# EAGLE design opencopcho (EAGLE 9.2.2)
Assembly variants: basic
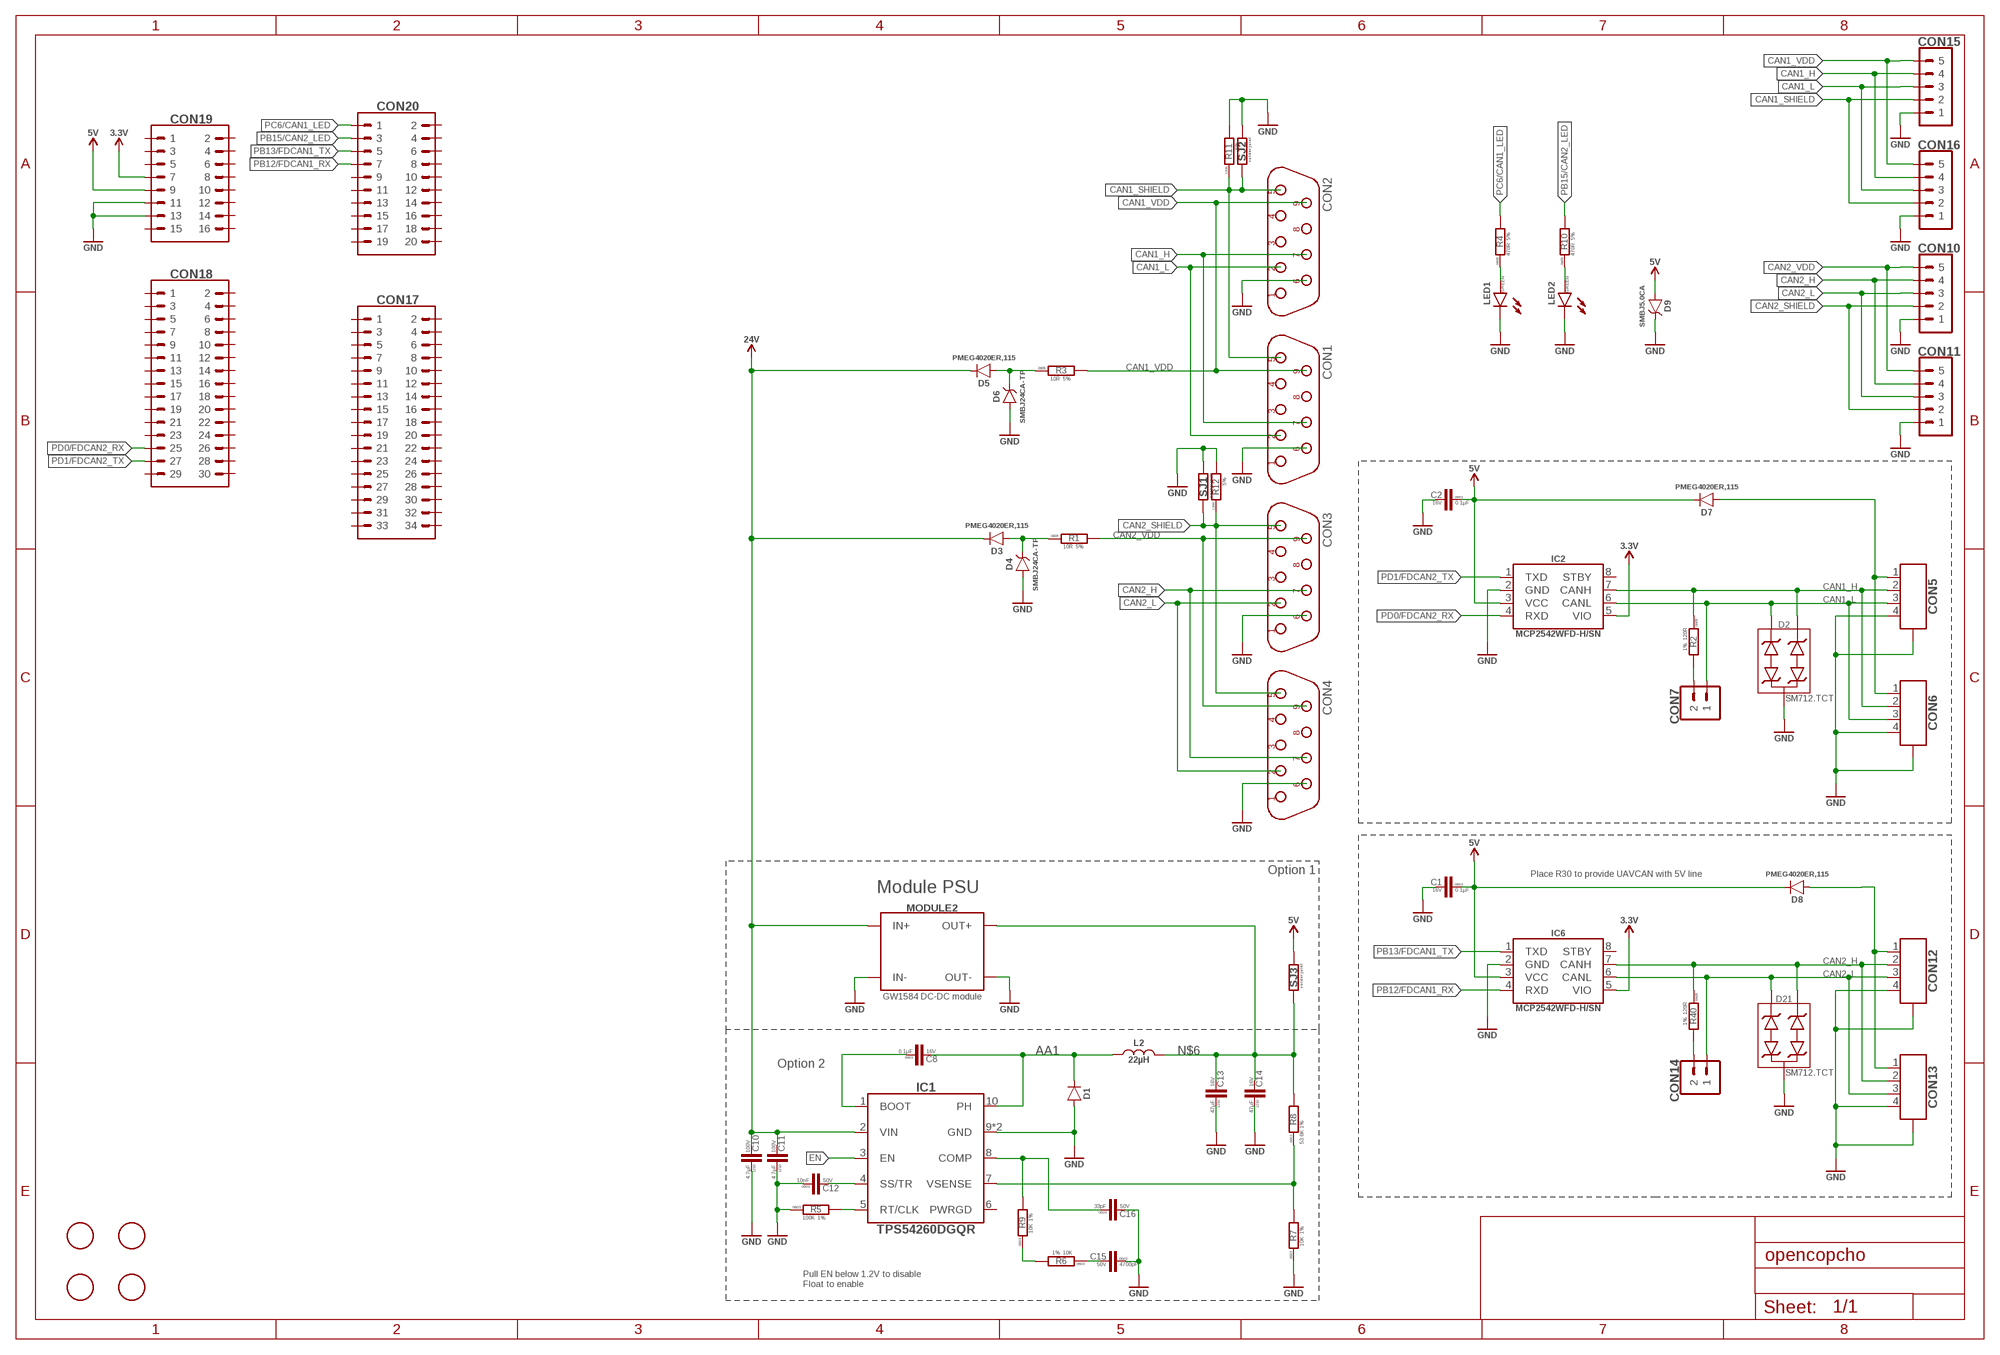
[diagram p0: schematic, sheet 1]

## Parts
C1  0.1µF  0.1µF-16V_10%_X7R-0603  [C0603]
C2  0.1µF  0.1µF-16V_10%_X7R-0603  [C0603]
C8  0.1µF  0.1µF-16V_10%_X7R-0603  [C0603]  (not fitted in variant basic)
C10  4.7µF  4.7µF-100V_20%_X7S-1210  [C1210]  (not fitted in variant basic)
C11  4.7µF  4.7µF-100V_20%_X7S-1210  [C1210]  (not fitted in variant basic)
C12  10nF  10NF-50V_10%_X7R-0603  [C0603]  (not fitted in variant basic)
C13  47µF  47µF-16V_20%_X5R-1210  [C1210]  (not fitted in variant basic)
C14  47µF  47µF-16V_20%_X5R-1210  [C1210]  (not fitted in variant basic)
C15  4700pF  4700PF-50V_10%_X7R-0603  [C0603]  (not fitted in variant basic)
C16  33pF  33PF-50V_5%_NP0-0603  [C0603]  (not fitted in variant basic)
CON1  DB9-M  [D-09M]
CON2  DB9-M  [D-09M]
CON3  DB9-M  [D-09M]
CON4  DB9-M  [D-09M]
CON5  CON-4P-JST_GH-RA  [JST_GH-4P-RA]
CON6  CON-4P-JST_GH-RA  [JST_GH-4P-RA]
CON7  PINHEAD_1X02-2.54  [1X02-PTH-2.54]
CON10  PINHEAD_1X05-2.54-KEY  [1X05-PTH-2.54-KEY]
CON11  PINHEAD_1X05-2.54-KEY  [1X05-PTH-2.54-KEY]
CON12  CON-4P-JST_GH-RA  [JST_GH-4P-RA]
CON13  CON-4P-JST_GH-RA  [JST_GH-4P-RA]
CON14  PINHEAD_1X02-2.54  [1X02-PTH-2.54]
CON15  PINHEAD_1X05-2.54-KEY  [1X05-PTH-2.54-KEY]
CON16  PINHEAD_1X05-2.54-KEY  [1X05-PTH-2.54-KEY]
CON17  PINHEAD_2X17-TH-FEMALE-LONG  [2X17-PTH-2.54-FEMALE-LONG_PINS]
CON18  PINHEAD_2X15-2.54-FEMALE-LONG  [2X15-PTH-2.54-FEMALE-LONG-PINS]
CON19  PINHEAD_2X08-TH-FEMALE-LONG  [2X08-PTH-2.54-FEMALE-LONG-PINS]
CON20  PINHEAD_2X10-2.54-TH-FEMALE-LONG  [2X10-PTH-2.54-FEMALE-LONG-PINS]
D1  B360B  [DO-214AA(SMB)]  (not fitted in variant basic)
D2  SM712  [SOT23B-3]
D3  PMEG4020  [SOD123W]
D4  SMBJ24CA-SMB  [DO-214AA(SMB)]
D5  PMEG4020  [SOD123W]
D6  SMBJ24CA-SMB  [DO-214AA(SMB)]
D7  PMEG4020  [SOD123W]
D8  PMEG4020  [SOD123W]
D9  SMBJ5.0CA-SMB  [DO-214AA(SMB)]
D21  SM712  [SOT23B-3]
IC1  TPS54260  [MSOP10]  (not fitted in variant basic)
IC2  MCP2542WFD  [SOIC8-3.9]
IC6  MCP2542WFD  [SOIC8-3.9]
L2  22µH  22µH-22U-SRP6540  [SRP6540]  (not fitted in variant basic)
LED1  LED-0805  [LED0805]
LED2  LED-0805  [LED0805]
MODULE2  GW1584_MODULE  [GW1584_MODULE]
R1  10R  R-5%-0805  [R0805]
R2  120R  R-1%-0805  [R0805]
R3  10R  R-5%-0805  [R0805]
R4  470R  R-5%-0805  [R0805]
R5  100K  100K-1%-0603  [R0603]  (not fitted in variant basic)
R6  10K  10K-1%-0603  [R0603]  (not fitted in variant basic)
R7  10K  10K-1%-0603  [R0603]  (not fitted in variant basic)
R8  53.6K 1%  R-1%-0603  [R0603]  (not fitted in variant basic)
R9  10K  10K-1%-0603  [R0603]  (not fitted in variant basic)
R10  470R  R-5%-0805  [R0805]
R11  R-5%-1206  [R1206]  (not fitted in variant basic)
R12  R-5%-1206  [R1206]  (not fitted in variant basic)
R40  120R  R-1%-0805  [R0805]
SJ1  SOLDER_JOINT  [RES_0]  (not fitted in variant basic)
SJ2  SOLDER_JOINT  [RES_0]
SJ3  SOLDER_JOINT  [RES_0]  (not fitted in variant basic)
U$5  FIDUCIALMOUNT  [FIDUCIA-MOUNT]  (not fitted in variant basic)
U$6  FIDUCIALMOUNT  [FIDUCIA-MOUNT]  (not fitted in variant basic)
U$7  FIDUCIALMOUNT  [FIDUCIA-MOUNT]  (not fitted in variant basic)
U$11  FIDUCIALMOUNT  [FIDUCIA-MOUNT]  (not fitted in variant basic)

## Nets
AA1: C8.P$2 D1.C IC1.10(PH) L2.1
CAN1_H: CON1.7 CON2.7 CON5.2 CON6.2 CON15.4 CON16.4 D2.1(C3) IC2.7(CANH) R2.1
CAN1_L: CON1.2 CON2.2 CON5.3 CON6.3 CON7.1 CON15.3 CON16.3 D2.2(C2) IC2.6(CANL)
CAN1_SHIELD: CON1.5 CON2.5 CON15.2 CON16.2 R11.P$1 SJ2.1
CAN1_VDD: CON1.9 CON2.9 CON15.5 CON16.5 R3.2
CAN2_H: CON3.7 CON4.7 CON10.4 CON11.4 CON12.2 CON13.2 D21.1(C3) IC6.7(CANH) R40.1
CAN2_L: CON3.2 CON4.2 CON10.3 CON11.3 CON12.3 CON13.3 CON14.1 D21.2(C2) IC6.6(CANL)
CAN2_SHIELD: CON3.5 CON4.5 CON10.2 CON11.2 R12.P$1 SJ1.1
CAN2_VDD: CON3.9 CON4.9 CON10.5 CON11.5 R1.2
EN: IC1.3(EN)
FB1: IC1.7(VSENSE) R7.P$2 R8.1
GND: C1.P$2 C2.P$2 C10.1 C11.1 C12.P$1 C13.1 C14.1 C15.P$1 C16.P$2 CON1.6 CON2.6 CON3.6 CON4.6 CON5.4 CON5.M$0(GND) CON5.M$1(GND) CON6.4 CON6.M$0(GND) CON6.M$1(GND) CON10.1 CON11.1 CON12.4 CON12.M$0(GND) CON12.M$1(GND) CON13.4 CON13.M$0(GND) CON13.M$1(GND) CON15.1 CON16.1 CON19.11 CON19.13 D1.A D2.3 D4.A D6.A D9.C D21.3 IC1.9(GND) IC1.TPAD(GND) IC2.2(GND) IC6.2(GND) LED1.C LED2.C MODULE2.IN-@1(IN-) MODULE2.IN-@2(IN-) MODULE2.OUT-@1(OUT-) MODULE2.OUT-@2(OUT-) R5.P$1 R7.P$1 R11.P$2 R12.P$2 SJ1.2 SJ2.2
N$1: C8.P$1 IC1.1(BOOT)
N$2: LED1.A R4.1
N$3: CON12.1 CON13.1 D8.A
N$4: C12.P$2 IC1.4(SS/TR)
N$5: CON7.2 R2.2
N$6: C13.2 C14.2 L2.2 MODULE2.OUT+@1(OUT+) MODULE2.OUT+@2(OUT+) R8.2 SJ3.1
N$7: LED2.A R10.1
N$8: CON5.1 CON6.1 D7.A
N$9: IC1.5(RT/CLK) R5.P$2
N$10: C16.P$1 IC1.8(COMP) R9.P$2
N$11: C15.P$2 R6.P$1
N$12: R6.P$2 R9.P$1
N$14: D5.A D6.C R3.1
N$16: D3.A D4.C R1.1
N$47: CON14.2 R40.2
PB12/FDCAN1_RX: CON20.7 IC6.4(RXD)
PB13/FDCAN1_TX: CON20.5 IC6.1(TXD)
PB15/CAN2_LED: CON20.3 R10.2
PC6/CAN1_LED: CON20.1 R4.2
PD0/FDCAN2_RX: CON18.25 IC2.4(RXD)
PD1/FDCAN2_TX: CON18.27 IC2.1(TXD)
VDD_3V3: CON19.7 IC2.5(VIO) IC6.5(VIO) ; supply symbol labelled 3.3V
VDD_5V: C1.P$1 C2.P$1 CON19.9 D7.C D8.C D9.A IC2.3(VCC) IC6.3(VCC) SJ3.2 ; supply symbol labelled 5V
VDD_24V: C10.2 C11.2 D3.C D5.C IC1.2(VIN) MODULE2.IN+@1(IN+) MODULE2.IN+@2(IN+) ; supply symbol labelled 24V
Unconnected: CON1.1 CON1.3 CON1.4 CON1.8 CON2.1 CON2.3 CON2.4 CON2.8 CON3.1 CON3.3 CON3.4 CON3.8 CON4.1 CON4.3 CON4.4 CON4.8 CON17.1 CON17.2 CON17.3 CON17.4 CON17.5 CON17.6 CON17.7 CON17.8 CON17.9 CON17.10 CON17.11 CON17.12 CON17.13 CON17.14 CON17.15 CON17.16 CON17.17 CON17.18 CON17.19 CON17.20 CON17.21 CON17.22 CON17.23 CON17.24 CON17.25 CON17.26 CON17.27 CON17.28 CON17.29 CON17.30 CON17.31 CON17.32 CON17.33 CON17.34 CON18.1 CON18.2 CON18.3 CON18.4 CON18.5 CON18.6 CON18.7 CON18.8 CON18.9 CON18.10 CON18.11 CON18.12 CON18.13 CON18.14 CON18.15 CON18.16 CON18.17 CON18.18 CON18.19 CON18.20 CON18.21 CON18.22 CON18.23 CON18.24 CON18.26 CON18.28 CON18.29 CON18.30 CON19.1 CON19.2 CON19.3 CON19.4 CON19.5 CON19.6 CON19.8 CON19.10 CON19.12 CON19.14 CON19.15 CON19.16 CON20.2 CON20.4 CON20.6 CON20.8 CON20.9 CON20.10 CON20.11 CON20.12 CON20.13 CON20.14 CON20.15 CON20.16 CON20.17 CON20.18 CON20.19 CON20.20 IC1.6(PWRGD) IC2.8(STBY) IC6.8(STBY)

## Notes on the sheet
- Option 1 | Place R30 to provide UAVCAN with 5V line
- Module PSU
- Option 2
- Pull EN below 1.2V to disable
  Float to enable
- https://ru.aliexpress.com/item/Special-offer-High-quality-150x60x25mm-radiator-Aluminum-heatsink-Extruded-profile-heat-sink-for-Electronic-heat/32241107174.html?spm=a2g0v.10010108.1000014.1.4d7c5e2d8QWO7B&gps-id=pcDetailBottomMoreOtherSeller&scm=1007.13338.107646.000000000000000&scm_id=1007.13338.107646.000000000000000&scm-url=1007.13338.107646.000000000000000&pvid=9ff5dfb5-2ae6-4b7b-b40d-963c8f3c5b20

## Library data of the parts
C1 C2 C8 = C_digikey:0.1µF; DIGIKEY#: 490-1532-1-ND; MANF: Murata Electronics North America; MANF#: GRM188R71C104KA01D; OPERATING_TEMP: -55°C ~ 125°C; PACKAGE: 0603; TC: X7R; TOLERANCE: +-10%; VOLTAGE: 16V
C10 C11 = C_digikey:4.7µF; DIGIKEY#: 445-6043-1-ND; MANF: TDK Corporation; MANF#: C3225X7S2A475M200AB; OPERATING_TEMP: -55°C ~ 125°C; PACKAGE: 1210; TC: X7S; TOLERANCE: +-20%; VOLTAGE: 100V
C12 = C_digikey:10NF; DIGIKEY#: 311-1085-1-ND; MANF: YAGEO; MANF#: CC0603KRX7R9BB103; OPERATING_TEMP: -55°C ~ 125°C; PACKAGE: 0603; TC: X7R; TOLERANCE: +-10%; VOLTAGE: 50V
C13 C14 = C_digikey:47µF; DIGIKEY#: 490-3888-1-ND; MANF: Murata Electronics North America; MANF#: GRM32ER61C476ME15L; OPERATING_TEMP: -55°C ~ 85°C; PACKAGE: 1210; TC: X5R; TOLERANCE: +-20%; VOLTAGE: 16V
C15 = C_digikey:4700PF; DIGIKEY#: 490-1506-1-ND; MANF: Murata Electronics North America; MANF#: GRM188R71H472KA01D; OPERATING_TEMP: -55°C ~ 125°C; PACKAGE: 0603; TC: X7R; TOLERANCE: +-10%; VOLTAGE: 50V
C16 = C_digikey:33PF; DIGIKEY#: 490-6126-1-ND; MANF: Murata Electronics North America; MANF#: GRM0335C1H330JA01D; OPERATING_TEMP: -55°C ~ 125°C; PACKAGE: 0603; TC: NP0; TOLERANCE: +-5%; VOLTAGE: 50V
CON1-CON4 = Connectors:DB9; DIGIKEY#: AE10973-ND; MANF: Assmann WSW Components; MANF#: A-DS 09 PP/Z
CON5 CON6 CON12 CON13 = Connectors:CON-4P: Connector Receptacle 4 Position 0.049" (1.25mm) Tin Surface Mount; DIGIKEY#: 455-1566-1-ND; MANF: JST Sales America Inc; MANF#: SM04B-GHS-TB(LF)(SN)
CON7 CON14 = pinhead:PINHEAD_1X02: pinheader 2P
CON10 CON11 CON15 CON16 = pinhead:PINHEAD_1X05: pinheader 5P; DIGIKEY#: S9413-ND; MANF: Sullins Connector Solutions; MANF#: SWR25X-NRTC-S05-ST-BA
CON17 = pinhead:PINHEAD_2X17; DIGIKEY#: SAM1196-17-ND; MANF: Samtec Inc; MANF#: SSQ-117-03-G-D
CON18 = pinhead:PINHEAD_2X15
CON19 = pinhead:PINHEAD_2X08; DIGIKEY#: SAM10008-ND; MANF: Samtec Inc; MANF#: SSQ-108-23-G-D
CON20 = pinhead:PINHEAD_2X10: 20 Position Receptacle Connector 0.079" (2.00mm) Surface Mount Gold; DIGIKEY#: SAM10741-ND; MANF: Samtec Inc; MANF#: SSQ-110-23-G-D
D1 = Diodes:B360B: DIODE SCHOTTKY 60V 3A SMB; DIGIKEY#: B360B-FDICT-ND; MANF: Diodes Incorporated; MANF#: B360B-13-F
D2 D21 = TVS_diodes:SM712: TVS DIODE 12VWM/7VWM SOT23; DIGIKEY#: SM712-TPMSCT-ND; MANF: Semtech Corporation; MANF#: SM712.TCT
D3 D5 D7 D8 = Diodes:PMEG4020: DIODE SCHOTTKY 40V 2A SOD123W; DIGIKEY#: 1727-5385-2-ND; IF: 2A; MANF: NXP Semiconductors; MANF#: PMEG4020ER,115; VOLTAGE: 40V
D4 D6 = TVS_diodes:SMBJ24CA: TVS DIODE 24V 38.9V DO214AA; DIGIKEY#: SMBJ24CA-TPMSCT-ND; MANF: Micro Commercial Co; MANF#: SMBJ24CA-TP
D9 = TVS_diodes:SMBJ5.0CA: TVS DIODE 51VWM SMD; DIGIKEY#: SMBJ5.0CABTR-ND; MANF: Bourns Inc; MANF#: SMBJ5.0CA
IC1 = dc-dc:TPS54260: IC REG BUCK ADJ 2.5A 10MSOP Datasheet <http://www.ti.com/lit/ds/slvsa86c/slvsa86c.pdf>; DIGIKEY#: 296-39415-2-ND; MANF: Texas Instruments; MANF#: TPS54260DGQR
IC2 IC6 = serial_interfaces:MCP2542WFD: 1/1 Transceiver CANbus 8-SOIC; DIGIKEY#: MCP2542WFD-H/SN-ND; MANF: Microchip Technology; MANF#: MCP2542WFD-H/SN
L2 = power_inductors:22µH: Wirewound Inductor; CURRENT_SAT: 2.5A; DIGIKEY#: SRP6540-4R7MCT-ND; MANF: Bourns Inc; MANF#: SRP6540-4R7M
LED1 LED2 = rc:LED: SMD LED; COLOR: GREEN
MODULE2 = dc-dc:GW1584_MODULE: THIS http://mysku.ru/blog/aliexpress/35938.html http://ru.aliexpress.com/item/New-Mini-Converter-Adjustable-DC-DC-Step-down-Power-Supply-Module-replace-LM2596/32411413046.html?spm=2114.30010708.3.314.AhmzLw&s=p&ws_ab_test=searchweb201556_6,searchweb201602_5_10017_10010_10011_10018_10019_10036_10035_10034_301_507_10033_10032_10020_10001_10002_10005_10006_10021_10003_10022_10004_401_10009_10007_10008_2030013,searchweb201603_9&btsid=8a54b1af-cc82-4f8d-a784-d3b67147a089
R1 R3 R4 R10 = rc:R; PACKAGE: 0805; TOLERANCE: 5%
R2 R40 = rc:R; PACKAGE: 0805; TOLERANCE: 1%
R5 = R_digikey:100K; DIGIKEY#: 311-100KHRCT-ND; MANF: Yageo; MANF#: RC0603FR-07100KL; PACKAGE: 0603; TOLERANCE: 1%
R6 R7 R9 = R_digikey:10K; DIGIKEY#: 311-10.0KHRCT-ND; MANF: Yageo; MANF#: RC0603FR-0710KL; PACKAGE: 0603; TOLERANCE: 1%
R8 = rc:R; DIGIKEY#: 311-53.6KHRCT-ND; MANF: Yageo; MANF#: RC0603FR-0753K6L; PACKAGE: 0603; TOLERANCE: 1%
R11 R12 = rc:R; PACKAGE: 1206; TOLERANCE: 5%
SJ1-SJ3 = usb2can_master_lib:SOLDER_JOINT
U$5-U$7 U$11 = usb2can_master_lib:FIDUCIALMOUNT

## Board
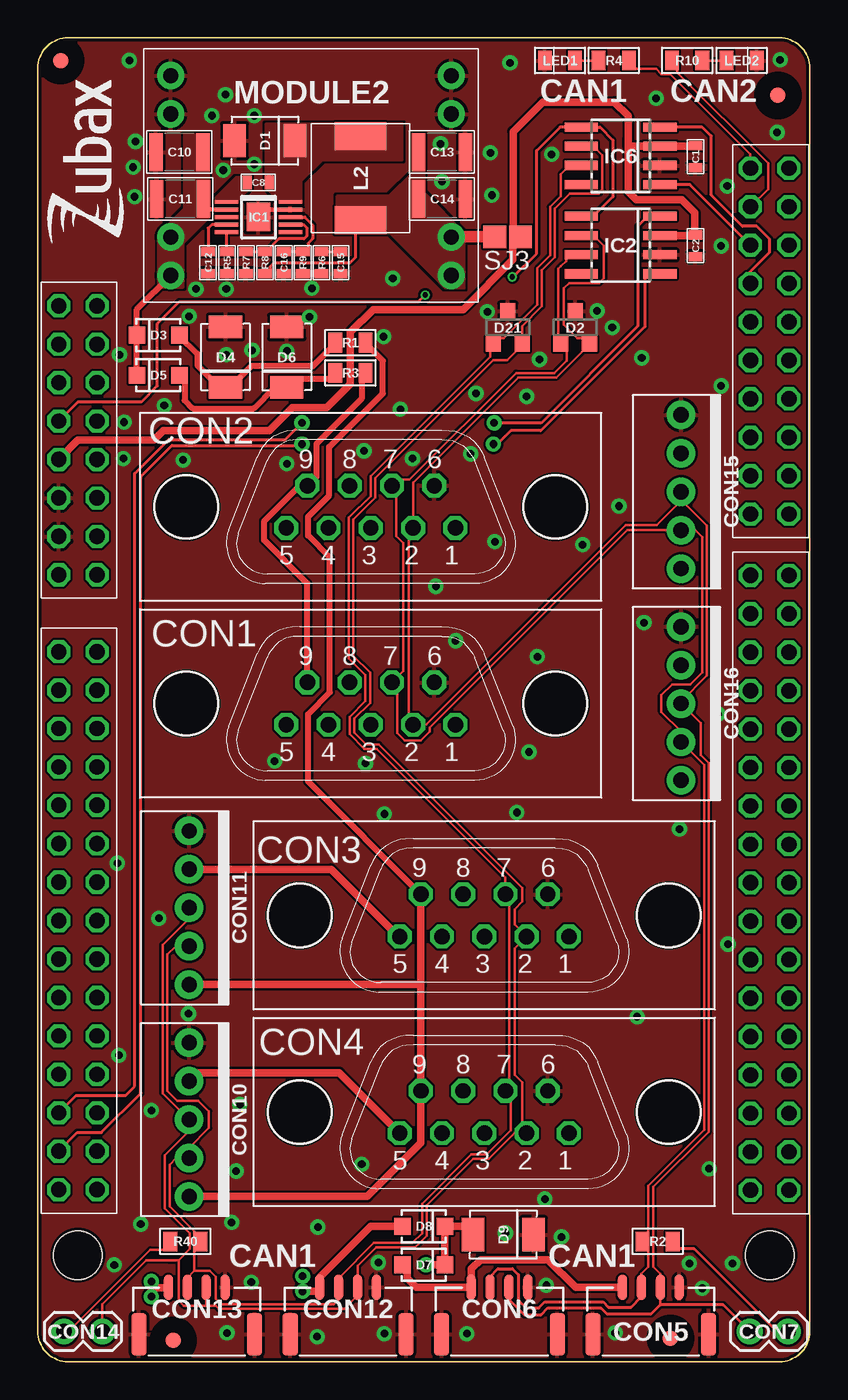
[diagram p1: board, top side]
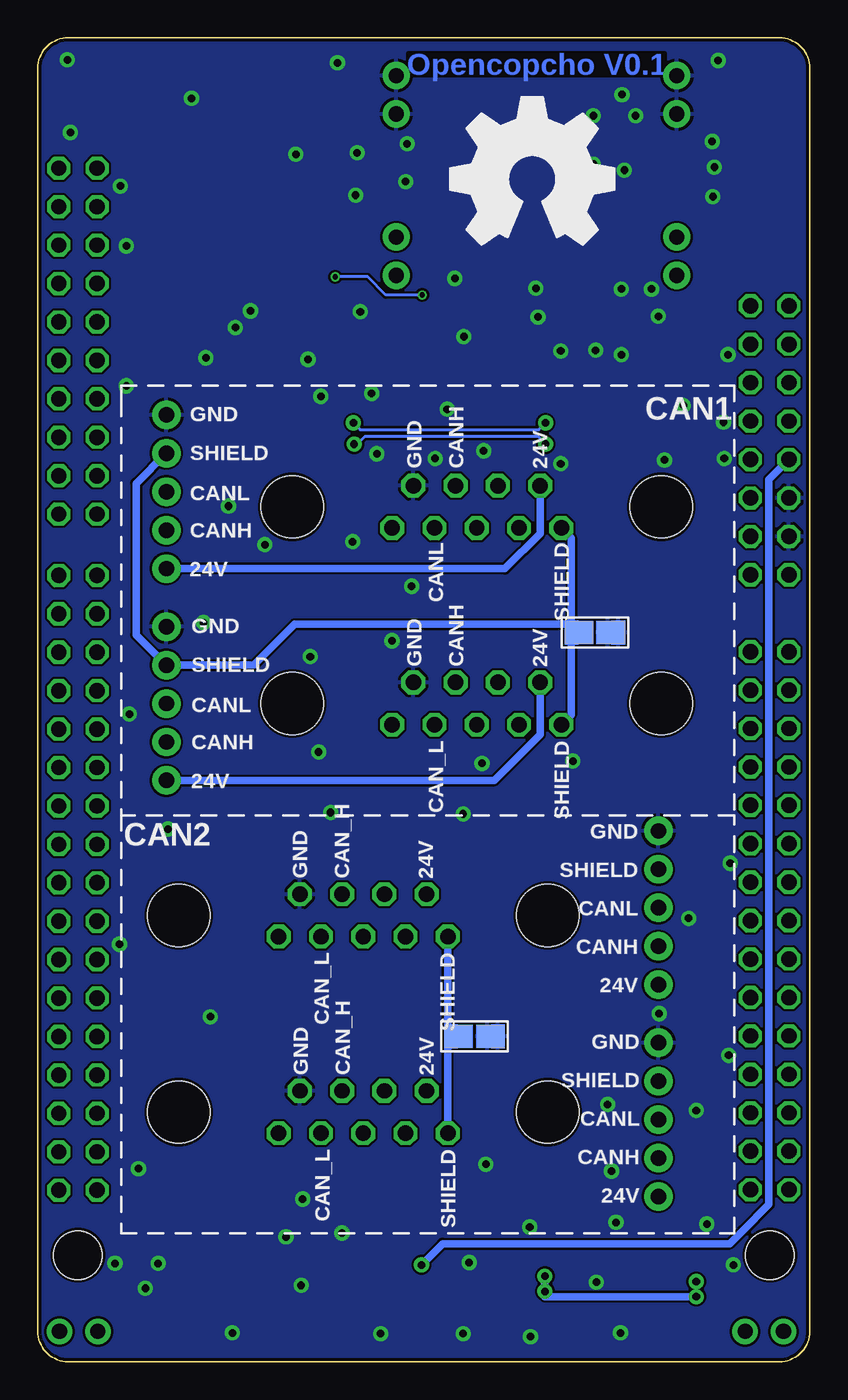
[diagram p2: board, bottom side, seen from below]

Size 51 x 87.5 mm. Coordinates in mm from the lower left corner, seen from the top.
Outline: 49,0 2,0 arc-90 0,2 0,85.5 arc-90 2,87.5 2.75,87.5 49,87.5 arc-90 51,85.5 51,2 arc-90 49,0
Copper layers (1*16): Top 0.035mm / dielectric 0.5mm / Bottom 0.035mm
Design rules "myxa *": minimum track width 0.15mm, minimum drill 0.2mm, track to track 0.15mm, track to pad 0.15mm, pad to pad 0.15mm, via to via 0.15mm, smd to smd 0.15mm, copper to edge 0.2mm, drill to drill 0.2mm, minimum pad ring 0.125mm, minimum via ring 0.125mm, stop-mask expansion 1mil, vias tented up to drill 0.31mm, thermal gap 8mil
Holes 3.2 mm at 2.64,7.04 48.36,7.04

### Footprints (pad centres in the part's own frame; a part is rotated, then mirrored left to right if it is on the bottom)
C0603 = smd 0.6 x 0.9: P$1 -0.725,0; P$2 0.725,0
C1210 = smd 0.9 x 2.5: 1 -1.55,0; 2 1.55,0
D-09M = drill 1.016 pad 1.575 octagon: 1 -5.588,1.397; 2 -2.794,1.397; 3 0,1.397; 4 2.794,1.397; 5 5.588,1.397; 6 -4.191,-1.397; 7 -1.397,-1.397; 8 1.397,-1.397; 9 4.191,-1.397 | hole 4.115: 12.192,0; -12.192,0
JST_GH-4P-RA = smd 0.6 x 1.7: 1 1.875,-2.91; 2 0.625,-2.91; 3 -0.625,-2.91; 4 -1.875,-2.91 | smd 1 x 2.8: M$0 -3.825,0.19; M$1 3.825,0.19
1X02-PTH-2.54 = drill 1 pad 1.7: 1 -1.27,0; 2 1.27,0
1X05-PTH-2.54-KEY = drill 1.016 pad 1.88: 1 -5.08,0; 2 -2.54,0; 3 0,0; 4 2.54,0; 5 5.08,0
2X17-PTH-2.54-FEMALE-LONG_PINS = drill 1.016 octagon: 1 -1.27,20.32; 2 1.27,20.32; 3 -1.27,17.78; 4 1.27,17.78; 5 -1.27,15.24; 6 1.27,15.24; 7 -1.27,12.7; 8 1.27,12.7; 9 -1.27,10.16; 10 1.27,10.16; 11 -1.27,7.62; 12 1.27,7.62; 13 -1.27,5.08; 14 1.27,5.08; 15 -1.27,2.54; 16 1.27,2.54; 17 -1.27,0; 18 1.27,0; 19 -1.27,-2.54; 20 1.27,-2.54; 21 -1.27,-5.08; 22 1.27,-5.08; 23 -1.27,-7.62; 24 1.27,-7.62; 25 -1.27,-10.16; 26 1.27,-10.16; 27 -1.27,-12.7; 28 1.27,-12.7; 29 -1.27,-15.24; 30 1.27,-15.24; 31 -1.27,-17.78; 32 1.27,-17.78; 33 -1.27,-20.32; 34 1.27,-20.32
2X15-PTH-2.54-FEMALE-LONG-PINS = drill 1.016 octagon: 1 -1.27,17.78; 2 1.27,17.78; 3 -1.27,15.24; 4 1.27,15.24; 5 -1.27,12.7; 6 1.27,12.7; 7 -1.27,10.16; 8 1.27,10.16; 9 -1.27,7.62; 10 1.27,7.62; 11 -1.27,5.08; 12 1.27,5.08; 13 -1.27,2.54; 14 1.27,2.54; 15 -1.27,0; 16 1.27,0; 17 -1.27,-2.54; 18 1.27,-2.54; 19 -1.27,-5.08; 20 1.27,-5.08; 21 -1.27,-7.62; 22 1.27,-7.62; 23 -1.27,-10.16; 24 1.27,-10.16; 25 -1.27,-12.7; 26 1.27,-12.7; 27 -1.27,-15.24; 28 1.27,-15.24; 29 -1.27,-17.78; 30 1.27,-17.78
2X08-PTH-2.54-FEMALE-LONG-PINS = drill 1.016 octagon: 1 -1.27,8.89; 2 1.27,8.89; 3 -1.27,6.35; 4 1.27,6.35; 5 -1.27,3.81; 6 1.27,3.81; 7 -1.27,1.27; 8 1.27,1.27; 9 -1.27,-1.27; 10 1.27,-1.27; 11 -1.27,-3.81; 12 1.27,-3.81; 13 -1.27,-6.35; 14 1.27,-6.35; 15 -1.27,-8.89; 16 1.27,-8.89
2X10-PTH-2.54-FEMALE-LONG-PINS = drill 1.016 octagon: 1 -1.27,11.43; 2 1.27,11.43; 3 -1.27,8.89; 4 1.27,8.89; 5 -1.27,6.35; 6 1.27,6.35; 7 -1.27,3.81; 8 1.27,3.81; 9 -1.27,1.27; 10 1.27,1.27; 11 -1.27,-1.27; 12 1.27,-1.27; 13 -1.27,-3.81; 14 1.27,-3.81; 15 -1.27,-6.35; 16 1.27,-6.35; 17 -1.27,-8.89; 18 1.27,-8.89; 19 -1.27,-11.43; 20 1.27,-11.43
DO-214AA(SMB) = smd 1.5 x 2.2: A -2,0; C 2,0
SOT23B-3 = smd 1 x 1: 1 -0.95,-1.1; 2 0.95,-1.1; 3 0,1.1
SOD123W = smd 1.1 x 1.1: A -1.4,0; C 1.4,0
MSOP10 = smd 1.55 x 0.25: 1 -2.113,1; 2 -2.113,0.5; 3 -2.113,0; 4 -2.113,-0.5; 5 -2.113,-1; 6 2.113,-1; 7 2.113,-0.5; 8 2.113,0; 9 2.113,0.5; 10 2.113,1 | smd 1.57 x 1.88: TPAD 0,0
SOIC8-3.9 = smd 2.2 x 0.6: 1 -2.6,1.905; 2 -2.6,0.635; 3 -2.6,-0.635; 4 -2.6,-1.905; 5 2.6,-1.905; 6 2.6,-0.635; 7 2.6,0.635; 8 2.6,1.905
SRP6540 = smd 1.85 x 3.4: 1 -2.775,0; 2 2.775,0
LED0805 = smd 0.9 x 1.3: A -1,0; C 1,0
GW1584_MODULE = drill 1 pad 1.8: IN+@1 9.271,6.604; IN+@2 9.271,4.064; IN-@1 9.271,-6.604; IN-@2 9.271,-4.064; OUT+@1 -9.271,6.604; OUT+@2 -9.271,4.064; OUT-@1 -9.271,-4.064; OUT-@2 -9.271,-6.604
R0805 = smd 0.9 x 1.3: 1 -1,0; 2 1,0
R0603 = smd 0.6 x 0.9: P$1 -0.725,0; P$2 0.725,0
R0603' = smd 0.6 x 0.9: 1 -0.725,0; 2 0.725,0
R1206 = smd 0.9 x 1.6: P$1 -1.55,0; P$2 1.55,0
RES_0 = smd 1.5 x 1.5: 1 -0.85,0; 2 0.85,0
FIDUCIA-MOUNT = smd 1.016 x 1.016: P$1 0,0

### Placement (x,y rotation side)
C1  43.45,79.65 270 top
C2  43.45,73.75 270 top
C8  14.57,77.95 0 top
C10  9.35,79.95 0 top
C11  9.4,76.85 0 top
C12  11.25,72.65 90 top
C13  26.7,79.95 180 top
C14  26.7,76.85 180 top
C15  20,72.65 90 top
C16  16.25,72.65 270 top
CON1  22,43.5 180 top
CON2  22,56.5 180 top
CON3  29.5,29.5 180 top
CON4  29.5,16.5 180 top
CON5  40.5,2 180 top
CON6  30.5,2 180 top
CON7  48.3,2 0 top
CON10  10,16 270 top
CON11  10,30 270 top
CON12  20.5,2 180 top
CON13  10.5,2 180 top
CON14  3,2 180 top
CON15  42.5,57.5 270 top
CON16  42.5,43.5 270 top
CON17  48.35,31.65 0 top
CON18  2.65,29.15 0 top
CON19  2.65,60.9 0 top
CON20  48.35,67.45 0 top
D1  15,80.7 0 top
D2  35.5,68.35 0 top
D3  7.95,67.85 180 top
D4  12.4,66.4 270 top
D5  7.95,65.2 180 top
D6  16.45,66.4 270 top
D7  25.5,6.4 0 top
D8  25.5,8.95 0 top
D9  30.75,8.4 0 top
D21  31.05,68.35 0 top
IC1  14.57,75.65 0 top
IC2  38.5,73.8 180 top
IC6  38.5,79.7 180 top
L2  21.32,78.22 270 top
LED1  34.5,86 180 top
LED2  46.5,86 0 top
MODULE2  18.05,78.4 180 top
R1  20.65,67.35 0 top
R2  40.95,7.95 0 top
R3  20.65,65.35 0 top
R4  38.05,86 0 top
R5  12.5,72.65 90 top
R6  18.75,72.65 270 top
R7  13.75,72.65 90 top
R8  53.6K 1%  [R0603']  15,72.65 270 top
R9  17.5,72.65 90 top
R10  42.9,86 180 top
R11  14.2,48.2 0 bottom
R12  22.15,21.5 0 bottom
R40  9.75,7.95 180 top
SJ1  22.15,21.5 0 bottom
SJ2  14.2,48.2 0 bottom
SJ3  31.04,74.35 0 top
U$1  [ZUBAX_LOGO_5X10]  5.85,73.85 90 top
U$4  [OSHW-10.5X11.5]  23.82,73.78 0 bottom
U$5  1.5,86 0 top
U$6  48.9,83.7 0 top
U$7  8.95,1.4 0 top
U$11  41.8,1.55 0 top

### Tracks (layer width: path | path; a pad name or v marks a point on that pad's centre or on a via)
AA1
  pour Top (no thermals): 17.38,76.62 16.07,76.62 15.1,77.6 15.1,81.83 24.05,81.83 24.05,79.42 18.77,79.42 17.38,78.03
CAN1_H
  Top 0.152: CON5.2 39.88,5.81 40.33,6.26 40.33,7.58 R2.1 40.33,8.33 40.33,11.62 44.03,15.33 44.03,39.43 CON16.4 42.5,41.65 41.2,42.95 41.2,44.05 41.9,44.75 43.1,44.75 43.9,45.55 43.9,54.5 43.4,55 43.36,54.96 CON15.4 38.94,54.96 25.9,41.92 25.9,41.65 25.3,41.05 24.25,41.05 23.75,41.55 23.75,44.55 CON1.7 24.15,45.65 24.15,54.1 23.7,54.55 23.7,57.6 CON2.7 23.8,58.3 24.55,58.3 31.6,65.35 34.12,65.35 34.95,66.18 34.95,66.85 D2.1 34.4,67.4 34.4,72.25 34.55,72.4 34.9,72.75 34.9,72.95 35.12,73.16 IC2.7
  Top 0.2: CON6.2 29.88,5.62 30.4,6.15 31.35,6.15 31.75,5.75 31.75,4.06 32.26,3.55 33.1,3.55 33.5,3.95 37.35,3.95 37.7,3.6 39.2,3.6 39.88,4.27 CON5.2
CAN1_L
  Top 0.152: CON5.3 41.12,5.81 40.67,6.26 40.67,10.3 40.67,11.55 44.33,15.2 44.33,39.57 43.8,40.1 43.8,42.2 CON16.3 42.5,43.65 44.2,45.35 44.2,55.25 42.5,56.95 | 42.5,56.95 CON15.3 | IC2.6 36.72,74.44 37.4,73.75 37.4,71.6 37.1,71.3 35.1,71.3 34.75,70.95 34.75,68.55 35.65,67.65 36.05,67.65 D2.2 34.25,65.05 31.75,65.05 24.79,58.09 CON2.2 24.49,54.8 24.49,42.4 CON1.2 25.65,42.1 38.85,55.3 40.9,55.3 42.5,56.9 42.5,56.95 | 41.12,3.75 41.12,4.55
  Top 0.2: CON6.3 31.12,4.12 32.15,3.1 33.25,3.1 33.7,3.55 37.2,3.55 37.6,3.15 40.52,3.15 41.12,3.75 45.28,3.75 CON7.1 | 41.12,4.55 CON5.3
CAN1_SHIELD
  Bottom 0.152: 15.76,48.2 R11.P$1 SJ2.1
  Bottom 0.5: 15.76,48.75 15.76,48.25 15.76,48.2 15.76,42.75 CON1.5 | CON2.5 15.76,54.45 15.76,48.75 | 15.76,48.75 16.41,48.75 34.04,48.75 36.75,46.04 CON16.2 44.5,48.04 44.5,58.04 CON15.2
CAN1_VDD
  Top 0.4: CON1.9 17.81,51.44 14.95,54.3 14.95,55.55 17.3,57.9 CON2.9 18.41,58.5 18.41,60.66 21.4,63.65 21.4,65.1 R3.2
  Bottom 0.5: CON15.5 20.14,52.42 17.81,54.75 CON2.9 | CON16.5 20.83,38.42 17.81,41.44 CON1.9
CAN2_H
  Top 0.152: 19.88,4.75 19.88,4.12 19.55,3.8 12.1,3.8 11.75,4.15 11.75,5.6 11.35,6 10.35,6 | 19.88,4.75 CON12.2 | IC6.7 35.2,79.06 35.12,79.06 34.55,78.5 34.55,77.03 33.85,76.33 33.85,73.12 33,72.28 33,71.65 33,69.88 30.77,67.65 30.4,67.65 30.1,67.35 D21.1 29.9,67.05 29.9,66.43 22,58.52 22,57.23 20.55,55.77 20.55,46.48 21.65,45.38 21.65,43.67 20.6,42.62 20.6,41.48 21.57,40.5 22.4,40.5 30.9,32 CON3.7 31.15,30.64 31.15,17.9 CON4.7 31.25,17.9 31.25,15.28 29.66,13.7 28.65,13.7 25.4,10.45 25.4,8.5 24.75,7.85 22.2,7.85 19.88,5.52 CON12.2 | 10.35,6 10.35,7.9 | 10.35,7.9 10.35,8.62 8.7,10.27 8.7,13.01 9.15,13.46 CON10.4 10,14.15 11.3,15.45 11.3,16.55 10.6,17.25 9.2,17.25 8.55,17.9 8.55,26.9 9.11,27.46 CON11.4 | R40.1 10.4,7.95 10.35,7.9 | CON12.2 19.88,4.75 | CON12.2 | 10.35,6 9.88,5.52 CON13.2
CAN2_L
  Top 0.152: 21.12,4.95 CON12.3 21.12,4.45 | 21.12,4.95 21.12,5.1 21.12,4.95 | 21.12,4.45 21.12,4.95 | CON4.2 32.27,15.12 | 32.27,15.12 32,15.4 32,18.45 31.5,18.95 31.5,27.31 CON3.2 31.5,28.9 31.5,29.9 32.01,30.41 32.01,31.32 22.53,40.8 21.7,40.8 20.9,41.6 20.9,42.5 21.95,43.55 21.95,45.55 20.85,46.65 20.85,55.65 22.3,57.1 22.3,58.25 22.3,58.4 30.1,66.2 31,66.2 32,67.2 D21.2 32,68.45 33.3,69.75 33.3,72.15 34.15,73 34.15,76.2 35.15,77.2 37.05,77.2 37.3,77.45 37.3,79.75 36.72,80.34 IC6.6 | 21.12,4.95 21.15,4.98 21.15,6.35 22.35,7.55 24.93,7.55 25.7,8.33 25.7,10.33 28.77,13.4 29.79,13.4 31.51,15.12 32.27,15.12 | 21.12,4.45 21.12,4.38 20.25,3.49 11.96,3.49 11.75,3.7 11.12,3.7 | CON13.3 11.12,3.7 | 9.3,6.7 10.04,7.45 10.04,8.5 8.4,10.15 8.4,13.65 10,15.25 CON10.3 8.25,17.75 8.25,27.55 10,29.3 CON11.3 | 9.3,6.7 8.65,6.7 7.17,6.7 4.27,3.8 CON14.1 | 11.12,3.7 9.65,3.7 9.3,4.05 9.3,6.7
CAN2_SHIELD
  Top 0.5: CON3.5 23.91,28 19.37,32.54 CON11.2 | CON10.2 10.56,19.1 19.91,19.1 CON4.5
  Bottom 0.152: 23.91,22.15 23.91,21.5 R12.P$1 SJ1.1
  Bottom 0.5: CON4.5 23.91,22.15 CON3.5
CAN2_VDD
  Top 0.4: CON3.9 17.85,38.36 17.85,42.8 19.3,44.25 19.3,53.15 17.85,54.6 17.85,55.85 19.25,57.25 19.25,60.45 22.8,64 22.8,66.15 21.65,67.3 R1.2
  Top 0.5: 25.31,24.85 CON4.9 25.31,14.46 21.77,10.92 CON10.5 | 25.31,24.85 CON3.9 | CON11.5 25.24,24.92 25.31,24.85
FB1
  Top 0.2: R7.P$2 R8.1 15.08,73.38 15.93,74.22 17.59,74.22 17.76,74.4 17.76,74.96 17.57,75.15 IC1.7
GND  (via drill 0.5 pad 1)
  Top 0.3: IC1.9 14.57,76.15 IC1.TPAD
  other vias: 36.95,69.45 29.7,69.4 37.95,68.35 33.15,66.25 32.3,63.8 28.95,64 33.6,5.05 34.6,8.25 30.9,8.5 33.5,10.75 22.5,6.55 12.5,1.9 18.45,1.65 22.9,1.85 28.35,1.85 13.35,17 21.4,13.05 13.1,12.6 14.1,5.25 12.4,83.75 23.45,71.6 10,69.1 12.45,66.55 17.95,69.05 22.85,67.75 18.1,70.95 12.45,70.9 16.45,66.8 14.15,66.85 33.95,79.8 38.15,1.9 43.9,4.85 43.05,6.5 18.5,8.9 12.8,9.2 44.35,12.75 45.9,6.5 39.6,22.8 45.6,27.6 42.4,35.2 44.95,42.8 40.05,48.85 31.65,36.3 32.45,40.3 22.9,36.2 21.65,39.55 15.65,39.7 27.6,47.65 33,46.6 26.3,51.25 36,54 30.2,54.2 24.75,59.7 28.6,60 23.95,62.95 21.55,60.2 16.45,59.35 45.15,73.75 39.9,66.35 38.4,56.55 45.15,64.5 5.25,32.95 7.5,16.6 5.05,6.4 6.8,9.1 5.35,20.25 8,29.3 9.95,23 8.35,63.2 5.7,62.1 5.65,59.7 9.6,59.6 5.4,66.55 6.05,86 45.55,77.7 40.85,83.5 48.85,81.25 49.05,86.05 31.2,85.85 30,77.1 29.9,79.9 26.6,80.5 26.7,78 12.25,78.75 14.3,82.35 11.5,82.35 6.45,80.65 6.3,78.95 6.4,77 10.45,70.9 14.3,79.15
  pour Top (rank 5): 50.95,87.47 0,87.47 0,-0.02 50.95,-0.02
  pour Bottom (rank 5): 0,87.47 50.95,87.47 50.95,-0.02 0,-0.02
N$1
  pour Top (no thermals): 11.8,76.62 11.8,76.97 13.12,78.3 14.05,78.3 14.05,77.6 13.07,76.62
N$2
  Top 0.152: R4.1 LED1.A
N$3  (via drill 0.5 pad 1)
  Top 0.5: D8.A 22,8.95 18.62,5.58 CON12.1 18.62,4.65 v17.5,4.65 | CON13.1 8.5,4.91 8.48,4.9 7.5,4.9 v7.5,5.3 v7.5,4.3
  Bottom 0.5: v7.5,4.3 17.5,4.3 v17.5,4.65 v17.5,5.65
N$4
  Top 0.2: IC1.4 11.47,75.15 11.25,74.92 C12.P$2
N$5
  Top 0.2: CON7.2 48.82,2 43.37,7.45 42.05,7.45 41.95,7.55 R2.2
N$6
  Top 0.2: R8.2 15.35,71.92 15.35,72.38 15.62,72.65 20.65,72.65 21,73 21,75.12 L2.2 | 27.31,74.35 MODULE2.OUT+@2
  Top 0.8: SJ3.1 MODULE2.OUT+@2
  pour Top (no thermals): 19.75,74.62 23.25,74.62 26.9,70.97 28.18,70.97 28.18,74.6 25.52,77.25 25.52,80.15 24.8,80.15 24.8,78.62 23.2,77.03 19.75,77.03
N$7
  Top 0.152: LED2.A R10.1
N$8
  Top 0.5: D7.A 24.4,6.1 24.4,5.52 24.99,4.91 CON6.1 28.62,6.12 29.25,6.75 33.7,6.75 35.54,4.91 CON5.1
N$9
  Top 0.2: IC1.5 12.46,73.41 R5.P$2
N$10
  Top 0.2: C16.P$1 R9.P$2 17.85,73.38 17.85,73.92 18.16,74.23 18.16,75.13 17.64,75.65 IC1.8
N$11
  Top 0.2: R6.P$1 C15.P$2
N$12
  Top 0.5: R9.P$1 R6.P$2
N$14
  Top 0.4: R3.1 19.65,64.95 16.45,64.95 D6.C 15.65,64.4 14.25,63 10.25,63 9.7,63.55 9.7,64.85 D5.A
N$16
  Top 0.4: R1.1 19.65,67.3 18.15,65.8 14.1,65.8 12.7,64.4 D4.C 12,64.4 10.55,65.85 10.55,66.6 9.35,67.8 D3.A
N$47
  Top 0.152: CON14.2 2.03,2 7.43,7.4 8.35,7.4 8.75,7.8 R40.2
PB12/FDCAN1_RX
  Top 0.2: CON20.7 47.08,72.06 48.35,73.33 48.35,74.2 47.5,75.05 46.55,75.05 44.5,77.1 44.5,81 43.89,81.6 IC6.4
PB13/FDCAN1_TX
  Top 0.2: CON20.5 43.09,77.8 IC6.1
PB15/CAN2_LED
  Top 0.152: CON20.3 48.25,77.51 48.25,79.2 42.25,85.2 42.25,85.65 R10.2
PC6/CAN1_LED
  Top 0.152: CON20.1 47.08,79.82 41.8,85.1 41.2,85.1 40.85,85.45 39.4,85.45 39.05,85.8 R4.2
PD0/FDCAN2_RX  (via drill 0.5 pad 1)
  Top 0.2: CON18.25 2.53,17.6 5.8,17.6 6.4,18.2 6.4,58.7 8.65,60.95 16.35,60.95 v17.45,62.05 | IC2.4 40.3,75.7 39.65,75.05 39.65,68.45 33.25,62.05 v30.15,62.05
  Bottom 0.2: v17.45,62.05 17.9,61.6 29.7,61.6 v30.15,62.05
PD1/FDCAN2_TX  (via drill 0.5 pad 1)
  Top 0.2: CON18.27 2.62,15.15 4.2,15.15 6.8,17.75 6.8,58.5 8.85,60.55 17.35,60.55 v17.45,60.65 | IC2.1 40.15,71.89 40.1,71.84 40.1,68.4 33.23,61.52 33.2,61.55 31.25,61.55 30.35,60.65 v30.1,60.65
  Bottom 0.2: v17.45,60.65 17.95,61.15 29.4,61.15 29.9,60.65 v30.1,60.65
VDD_3V3  (via drill 0.35)
  Top 0.2: CON19.7 2.66,63.45 6.85,63.45 7.9,64.5 7.9,68.6 9.35,70.05 25.15,70.05 v25.6,70.5 | IC2.5 36.7,75.7 38,77 38,80.75 37.14,81.6 IC6.5 34.51,81.6 32.95,80.05 32.95,73.25 31.4,71.7 v31.35,71.7
  Bottom 0.2: v25.6,70.5 28,70.5 29.2,71.7 v31.35,71.7
VDD_5V  (via drill 0.5 pad 1)
  Top 0.5: 39.02,80.34 39,80.35 39,80.8 39,82.35 38.1,83.25 33.35,83.25 31.4,81.3 31.4,74.84 SJ3.2 31.39,73.85 31.39,72.84 28.1,69.55 22.15,69.55 20.65,68.05 20.65,64.6 19.1,63.05 17.65,63.05 16.8,63.05 15.3,61.55 8.3,61.55 7.65,60.9 2.65,60.9 CON19.9 | 39.02,80.34 IC6.3 43.41,80.34 C1.P$1 | 43.41,74.44 C2.P$1 | 39.02,80.34 39.02,77.34 39.55,76.8 42.55,76.8 43.41,75.94 43.41,74.44 | IC2.3 43.41,74.44 | D9.A 28.2,8.95 D8.C D7.C v25.65,6.4
  Bottom 0.5: CON19.9 2.7,58.31 2.7,10.4 4.48,8.62 5.3,7.8 24.25,7.8 v25.65,6.4
VDD_24V
  Top 0.25: IC1.2 10.95,76.15 C11.2
  Top 0.4: D5.C D3.C 6.55,69.57 MODULE2.IN+@1
  pour Top (no thermals): 9.57,71 8,71 8,74.53 9.7,76.22 9.7,81.1 11.25,81.1 11.25,75.58 9.57,73.9

### Text on the board
Bottom: Opencopcho V0.1
tPlace: CAN1 | CAN2 | CAN1 | CAN1
bPlace: CAN1 | GND | SHIELD | 24V | CANH | GND | CANL | CANH | SHIELD | CANL | 24V | GND | 24V | CANH | GND | SHIELD | CANL | SHIELD | CAN_L | CANH | 24V | GND | CAN2 | SHIELD | 24V | CAN_H | GND | CANL | CANH | SHIELD | CAN_L | 24V | GND | SHIELD | 24V | CAN_H | GND | CANL | CANH | SHIELD | CAN_L | 24V